# EAGLE design OSO-MISC-21-020 Temperature + GPIO Board (EAGLE 9.6.2)
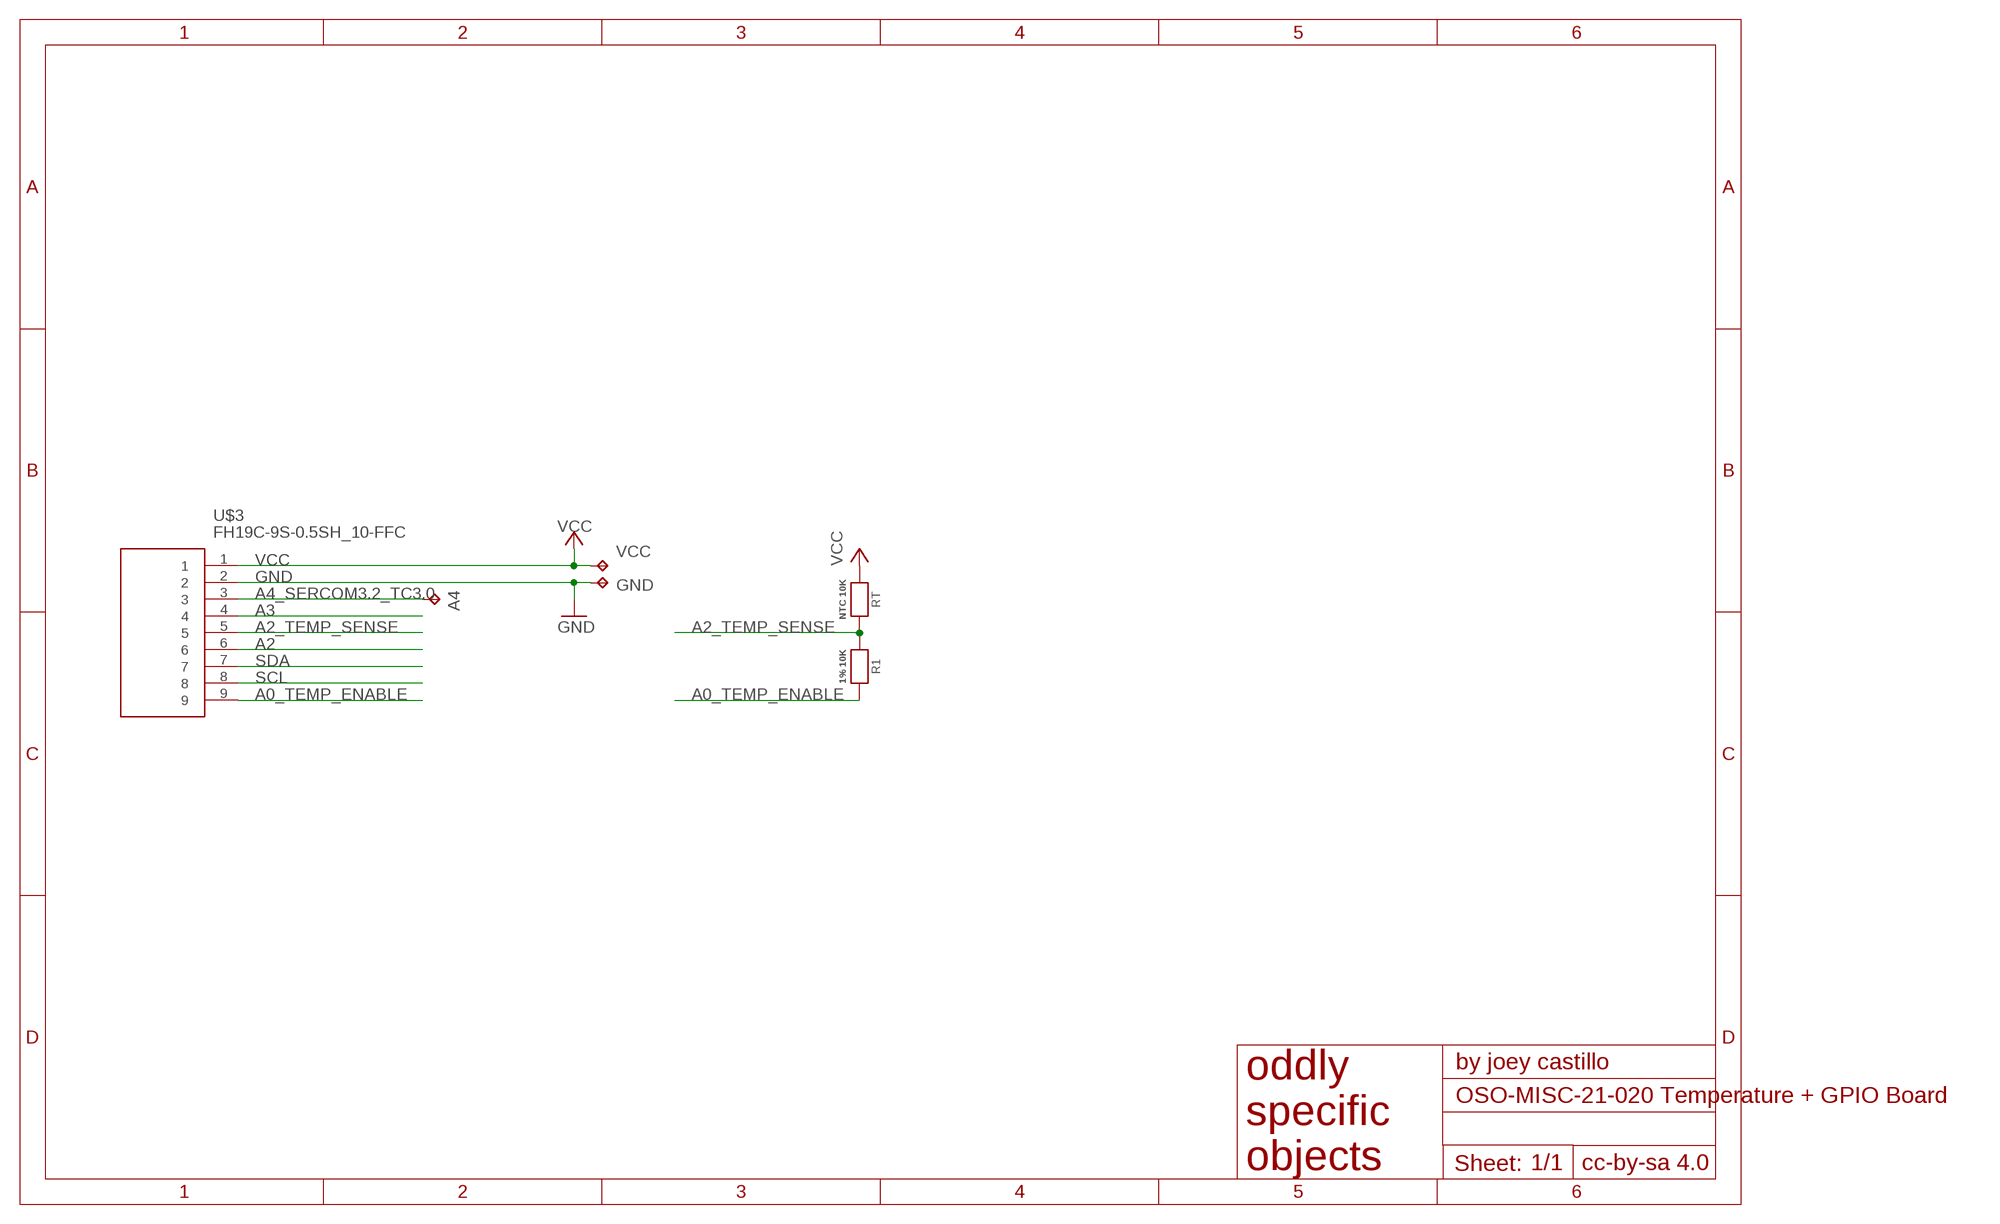
[diagram p0: schematic, sheet 1]

## Parts
A4  TPB1,27  [B1,27]
GND  TPB1,27  [B1,27]
R1  1% 10K  RESISTOR_0603MP  [_0603MP]
RT  NTC 10K  RESISTOR_0603  [_0603]
U$3  FH19C-9S-0.5SH_10-FFC  [FH19C9S05SH10-FFC]
VCC  TPB1,27  [B1,27]

## Nets
A0_TEMP_ENABLE: R1.2 U$3.9
A2: U$3.6
A2_TEMP_SENSE: R1.1 RT.2 U$3.5
A3: U$3.4
A4_SERCOM3.2_TC3.0: A4.TP U$3.3
GND [gnd]: GND.TP U$3.2
SCL: U$3.8
SDA: U$3.7
VCC [power]: RT.1 U$3.1 VCC.TP

## Library data of the parts
A4 GND VCC = testpad:TP: Test pad
R1 RT = microbuilder:RESISTOR: Resistors For new designs, use the packages preceded by an '_' character since they are more reliable: The following footprints should be used on most boards: _0402 - Standard footprint for regular board layouts _0603 - Standard footprint for regular board layouts _0805 - Standard footprint for regular board layouts _1206 - Standard footprint for regular board layouts For extremely tight-pitch boards where space is at a premium, the following 'micro-pitch' footprints can be used (smaller pads, no silkscreen outline, etc.): _0402MP - Micro-pitch footprint for very dense/compact boards _0603MP - Micro-pitch footprint for very dense/compact boards _0805MP - Micro-pitch footprint for very dense/compact boards _1206MP - Micro-pitch footprint for very dense/compact boards
U$3 = FH19C-9S-0.5SH:FH19C-9S-0.5SH_10-FFC

## Net classes
0 default: width 0.203 mm
1 power: width 0.203 mm
2 gnd: width 0.203 mm

## Board
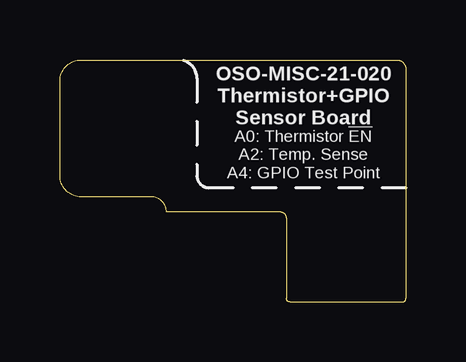
[diagram p1: board, top side]
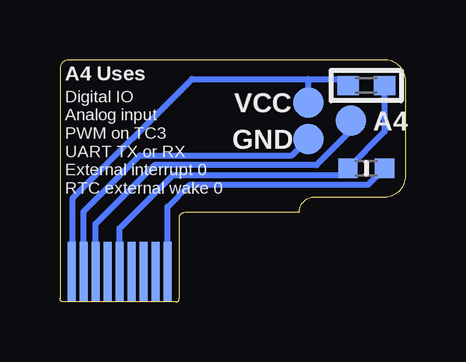
[diagram p2: board, bottom side, seen from below]

Size 14.43 x 10.1 mm. Coordinates in mm from the lower left corner, seen from the top.
Outline: 9.45,3.5 arc90 9.2,3.75 4.45,3.75 arc90 3.81,4.39 0.89,4.39 arc-90 0,5.28 0,9.21 arc-90 0.89,10.1 14.05,10.1 arc-90 14.43,9.72 14.43,3.5
Copper layers (1*16): Top 0.035559375mm / dielectric 1.6mm / Bottom 0.035559375mm
Design rules "oshpark-2layer *": minimum track width 6mil, minimum drill 10mil, track to track 6mil, track to pad 6mil, pad to pad 6mil, via to via 6mil, smd to smd 6mil, copper to edge 15mil, drill to drill 6mil, minimum pad ring 5mil, minimum via ring 5mil, stop-mask expansion 2.5mil, vias tented up to drill 12mil, thermal gap 10mil

### Footprints (pad centres in the part's own frame; a part is rotated, then mirrored left to right if it is on the bottom)
B1,27 = smd 1.27 x 1.27: TP 0,0
_0603MP = smd 0.8 x 0.8: 1 -0.762,0; 2 0.762,0
_0603 = smd 0.9 x 0.8: 1 -0.762,0; 2 0.762,0
FH19C9S05SH10-FFC = smd 0.347 x 2.5 bottom: 1 2,-2.25; 2 1.5,-2.25; 3 1,-2.25; 4 0.5,-2.25; 5 0,-2.25; 6 -0.5,-2.25; 7 -1,-2.25; 8 -1.5,-2.25; 9 -2,-2.25

### Placement (x,y rotation side)
A4  2.29,7.56 0 bottom
GND  4.06,6.8 0 bottom
R1  1.65,5.58 0 bottom
RT  1.65,9.04 0 bottom
U$3  11.94,3.5 0 top
VCC  4.06,8.33 0 bottom

### Tracks (layer width: path | path; a pad name or v marks a point on that pad's centre or on a via)
A0_TEMP_ENABLE
  Bottom 0.254: U$3.9 9.94,3.98 9.01,4.9 1.57,4.9 R1.2
A2_TEMP_SENSE
  Bottom 0.254: U$3.5 11.94,3.08 9.71,5.31 2.69,5.31 R1.1 0.89,7.11 RT.2
A4_SERCOM3.2_TC3.0
  Bottom 0.254: U$3.3 12.94,3.26 10.48,5.72 3.73,5.72 2.29,7.16 A4.TP
GND
  Bottom 0.254: U$3.2 13.44,3.78 11.09,6.12 4.74,6.12 GND.TP
VCC
  Bottom 0.254: U$3.1 13.91,1.28 13.91,4.32 8.92,9.31 4.06,9.31 | 4.06,9.31 2.79,9.31 2.52,9.04 RT.1 | VCC.TP 4.06,9.31

### Text on the board
tPlace: OSO-MISC-21-020 / Thermistor+GPIO / Sensor Board | A0: Thermistor !EN / A2: Temp. Sense / A4: GPIO Test Point
bPlace: A4 Uses | Digital IO / Analog input / PWM on TC3 / UART TX or RX / External interrupt 0 / RTC external wake 0